# EAGLE design breakout_STM32F030F4P6 (EAGLE 7.2.0)
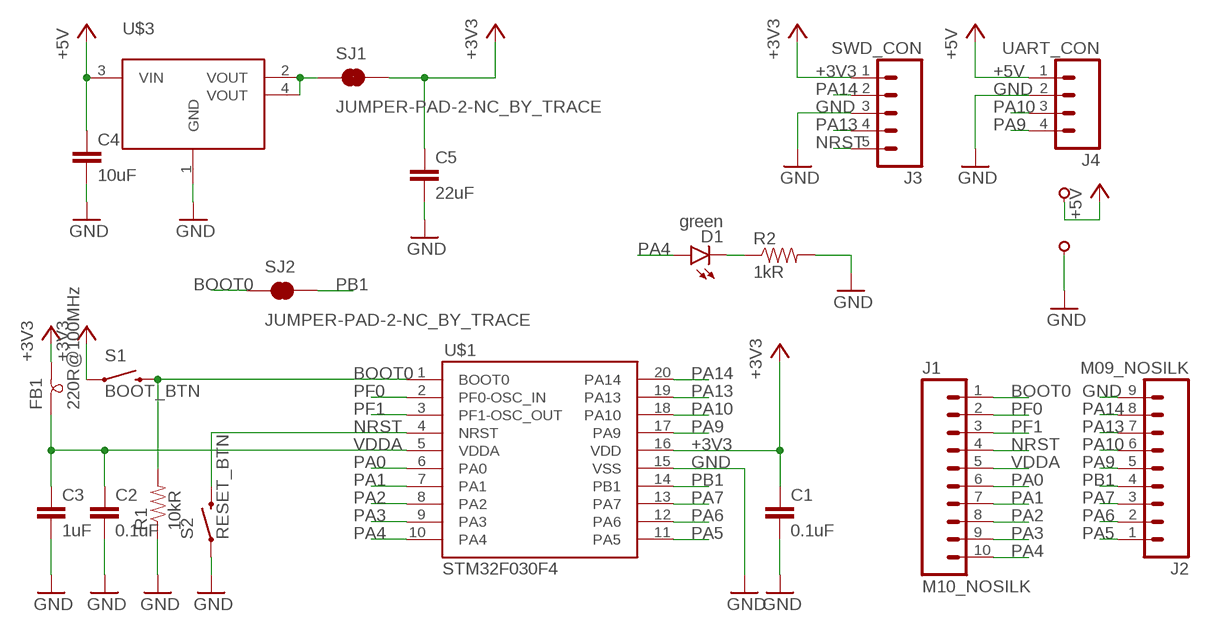
[diagram p0: schematic, sheet 1]

## Parts
C1  0.1uF  CAPACITOR0805  [0805]
C2  0.1uF  CAPACITOR0805  [0805]
C3  1uF  CAPACITOR0805  [0805]
C4  10uF  CAPACITOR0805  [0805]
C5  22uF  CAPACITOR0805  [0805]
D1  green  LED805  [LED-805]
FB1  220R@100MHz  FERRITE-BEAD0805  [0805]
J1  M10_NOSILK  [M10_NOSILK]
J2  M09_NOSILK  [M09_NOSILK]
J3  SWD_CON  M05_NOSILK_1SQ  [M05_NOSILK_1SQ]
J4  UART_CON  M04_NOSILK_1SQ  [M04_NOSILK_1SQ]
R1  10kR  RESISTOR0805  [0805]
R2  1kR  RESISTOR0805  [0805]
S1  BOOT_BTN  SWITCH-MOMENTARY-2-SMD-1101NE  [TACTILE-SWITCH-1101NE]
S2  RESET_BTN  SWITCH-MOMENTARY-2-SMD-1101NE  [TACTILE-SWITCH-1101NE]
SJ1  JUMPER-PAD-2-NC_BY_TRACE  [PAD-JUMPER-2-NC_BY_TRACE_YES_SILK]
SJ2  JUMPER-PAD-2-NC_BY_TRACE  [PAD-JUMPER-2-NC_BY_TRACE_YES_SILK]
U$1  STM32F030F4  [TSSOP-20]
U$2  M01_1SQ  [M01_1SQ]
U$3  AMS1117_SOT223  [SOT223]
U$4  M01_NOSILK  [M01_NOSILK]

## Nets
+3V3: C1.1 C5.1 FB1.2 J3.1 S1.1 SJ1.2 U$1.16(VDD)
+5V: C4.1 J4.1 U$2.1 U$3.3(VIN)
BOOT0: J1.1 R1.2 S1.2 SJ2.1 U$1.1(BOOT0)
GND: C1.2 C2.2 C3.2 C4.2 C5.2 J2.9 J3.3 J4.2 R1.1 R2.2 S2.1 U$1.15(VSS) U$3.1(GND) U$4.1
N$1: SJ1.1 U$3.2(VOUT) U$3.4(VOUT)
N$5: D1.C R2.1
NRST: J1.4 J3.5 S2.2 U$1.4(NRST)
PA0: J1.6 U$1.6(PA0)
PA1: J1.7 U$1.7(PA1)
PA2: J1.8 U$1.8(PA2)
PA3: J1.9 U$1.9(PA3)
PA4: D1.A J1.10 U$1.10(PA4)
PA5: J2.1 U$1.11(PA5)
PA6: J2.2 U$1.12(PA6)
PA7: J2.3 U$1.13(PA7)
PA9: J2.5 J4.4 U$1.17(PA9)
PA10: J2.6 J4.3 U$1.18(PA10)
PA13: J2.7 J3.4 U$1.19(PA13)
PA14: J2.8 J3.2 U$1.20(PA14)
PB1: J2.4 SJ2.2 U$1.14(PB1)
PF0: J1.2 U$1.2(PF0-OSC_IN)
PF1: J1.3 U$1.3(PF1-OSC_OUT)
VDDA: C2.1 C3.1 FB1.1 J1.5 U$1.5(VDDA)

## Library data of the parts
C1-C5 = flabbergast:CAPACITOR
D1 = flabbergast:LED: Blue LEDs for production use Various blue LEDs stocked by SparkFun production 0603 - DIO-08575 Rebel - DIO-09553 1206 - DIO-09911
FB1 = flabbergast:FERRITE-BEAD
J1 = flabbergast:M10
J2 = flabbergast:M09
J3 = flabbergast:M05
J4 = flabbergast:M04
R1 R2 = flabbergast:RESISTOR
S1 S2 = SparkFun-Electromechanical:SWITCH-MOMENTARY-2: Various NO switches- pushbuttons, reed, etc
SJ1 SJ2 = SparkFun-Passives:JUMPER-PAD-2-NC_BY_TRACE
U$1 = flabbergast:STM32F030F4
U$2 U$4 = flabbergast:M01
U$3 = flabbergast:AMS1117

## Board
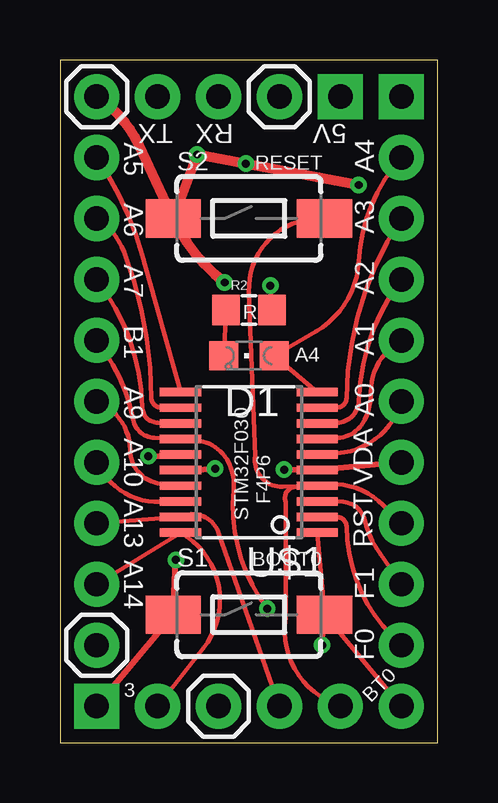
[diagram p1: board, top side]
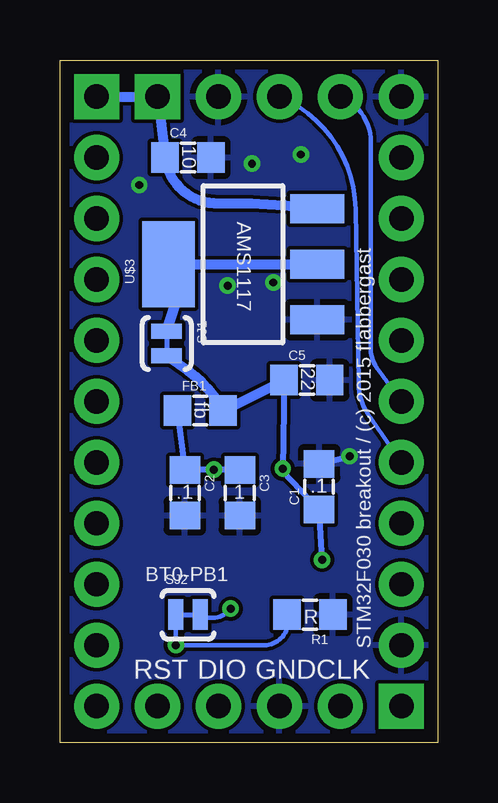
[diagram p2: board, bottom side, seen from below]

Size 15.75 x 28.45 mm. Coordinates in mm from the lower left corner, seen from the top.
Outline: 0,0 15.75,0 15.75,28.45 0,28.45 0,0
Copper layers (1*16): Top 0.0356mm / dielectric 1.5011mm / Bottom 0.0356mm
Design rules "LaenPCBOrder *": minimum track width 6mil, minimum drill 13mil, track to track 6mil, track to pad 6mil, pad to pad 6mil, via to via 6mil, smd to smd 0mil, copper to edge 15mil, drill to drill 6mil, minimum pad ring 7mil, minimum via ring 7mil, stop-mask expansion 3mil, vias tented up to drill 25mil, thermal gap 10mil

### Footprints (pad centres in the part's own frame; a part is rotated, then mirrored left to right if it is on the bottom)
0805 = smd 1.143 x 1.27: 1 -0.953,0; 2 0.953,0
LED-805 = smd 1.2 x 1.2: A 0,-1.05; C 0,1.05
M10_NOSILK = drill 1.016 pad 1.88: 1 -10.16,0; 2 -7.62,0; 3 -5.08,0; 4 -2.54,0; 5 0,0; 6 2.54,0; 7 5.08,0; 8 7.62,0; 9 10.16,0; 10 12.7,0
M09_NOSILK = drill 1.016 pad 1.88: 1 -10.16,0; 2 -7.62,0; 3 -5.08,0; 4 -2.54,0; 5 0,0; 6 2.54,0; 7 5.08,0; 8 7.62,0; 9 10.16,0
M05_NOSILK_1SQ = drill 1.016 pad 1.88 square: 1 -5.08,0 | drill 1.016 pad 1.88: 2 -2.54,0; 3 0,0; 4 2.54,0; 5 5.08,0
M04_NOSILK_1SQ = drill 1.016 pad 1.88 square: 1 -3.81,0 | drill 1.016 pad 1.88: 2 -1.27,0; 3 1.27,0; 4 3.81,0
TACTILE-SWITCH-1101NE = smd 2.3 x 1.6: 1 -3.15,0; 2 3.15,0
PAD-JUMPER-2-NC_BY_TRACE_YES_SILK = smd 0.635 x 1.27: 1 -0.508,0; 2 0.508,0
TSSOP-20 = smd 0.35 x 1.727: 1 -2.925,-2.845; 2 -2.275,-2.845; 3 -1.625,-2.845; 4 -0.975,-2.845; 5 -0.325,-2.845; 6 0.325,-2.845; 7 0.975,-2.845; 8 1.625,-2.845; 9 2.275,-2.845; 10 2.925,-2.845; 11 2.925,2.845; 12 2.275,2.845; 13 1.625,2.845; 14 0.975,2.845; 15 0.325,2.845; 16 -0.325,2.845; 17 -0.975,2.845; 18 -1.625,2.845; 19 -2.275,2.845; 20 -2.925,2.845
M01_1SQ = drill 1.016 pad 1.88 square: 1 0,0
SOT223 = smd 1.219 x 2.235: 1 -2.311,-3.099; 2 0,-3.099; 3 2.311,-3.099 | smd 3.6 x 2.2: 4 0,3.099
M01_NOSILK = drill 1.016 pad 1.88: 1 0,0

### Placement (x,y rotation side)
C1  4.95,10.67 90 bottom
C2  10.54,10.41 270 bottom
C3  8.25,10.41 270 bottom
C4  10.41,24.38 0 bottom
C5  5.46,15.11 0 bottom
D1  7.87,16.13 90 top
FB1  9.91,13.84 0 bottom
J1  14.22,11.68 90 top
J2  1.52,14.22 270 top
J3  6.6,1.52 0 top
J4  7.87,26.92 180 top
R1  5.33,5.33 180 bottom
R2  7.87,18.03 0 top
S1  7.87,5.33 0 top
S2  7.87,21.84 0 top
SJ1  11.3,16.64 270 bottom
SJ2  10.41,5.33 0 bottom
U$1  7.87,11.68 90 top
U$2  14.22,26.92 0 top
U$3  8.13,19.94 90 bottom
U$4  1.52,26.92 0 top

### Tracks (layer width: path | path; a pad name or v marks a point on that pad's centre or on a via)
+3V3  (via drill 0.33)
  Top 0.254: U$1.16 v6.47,11.42 | J3.1 S1.1 v4.83,7.62
  Bottom 0.254: C5.1 v6.47,11.42 6.48,11.3 C1.1 v4.83,7.62
  Bottom 0.406: SJ1.2 10.41,15.49 arc26 FB1.2 C5.1
+5V
  Bottom 0.406: U$2.1 J4.1 C4.1 arc-85 9.14,22.48 arc9 U$3.3
BOOT0  (via drill 0.33)
  Top 0.178: U$1.1 S1.2 | S1.2 J1.1 | S1.2 v10.92,4.06
  Bottom 0.178: R1.2 arc106 7.24,4.06 v10.92,4.06 SJ2.1
GND  (via drill 0.33)
  Top 0.178: R2.2 v8.76,19.05
  Top 0.254: v3.68,11.94 U$1.15
  Top 0.406: S2.1 3.3,24.89 arc32 U$4.1 | S2.1 arc27 v6.86,19.18 | S2.1 v5.71,24.51 v12.45,23.24
  Bottom 0.254: C1.2 v3.68,11.94
  other vias: 7.75,24.13
  pour Bottom: 0.25,0.25 15.49,0.25 15.49,28.19 0.25,28.19
N$1
  Bottom 0.406: U$3.4 10.41,19.94 | 10.41,19.94 U$3.2 | SJ1.1 10.41,19.94
N$5
  Top 0.178: D1.C R2.1
NRST
  Top 0.178: J1.4 13.46,9.91 arc57 U$1.4 | U$1.4 arc-19 9.91,10.67 arc116 9.4,10.03 9.4,5.21 arc81 J3.5 | U$1.4 9.27,10.67 arc-99 8.13,11.94 7.87,18.8 arc-96 S2.2
PA0
  Top 0.178: U$1.6 11.56,12.06 arc70 J1.6
PA1
  Top 0.178: U$1.7 11.56,12.7 arc62 12.7,13.46 arc26 12.95,14.61 arc-62 J1.7
PA2
  Top 0.178: U$1.8 11.56,13.33 arc86 12.45,14.22 arc-35 J1.8
PA3
  Top 0.178: U$1.9 11.56,13.97 arc89 11.94,14.35 arc-32 J1.9
PA4
  Top 0.178: U$1.10 D1.A 10.67,17.14 arc57 12.45,20.07 arc-39 J1.10
PA5
  Top 0.178: U$1.11 3.43,20.32 arc19 J2.1
PA6
  Top 0.178: U$1.12 4.19,13.97 arc-89 3.81,14.35 arc20 2.67,20.45 arc38 J2.2
PA7
  Top 0.178: U$1.13 4.06,13.33 arc-87 3.43,13.97 arc36 J2.3
PA9
  Top 0.178: U$1.17 4.19,10.79 arc-84 2.92,12.19 arc68 J2.5
  Bottom 0.178: J2.5 2.54,15.62 arc40 2.79,16.51 2.79,25.02 arc-67 J4.4
PA10
  Top 0.178: U$1.18 4.19,10.03 arc-67 J2.6
  Bottom 0.178: J2.6 2.92,13.72 arc36 3.3,14.99 3.43,22.23 arc-66 J4.3
PA13
  Top 0.178: J3.4 6.6,8.76 arc97 U$1.19 J2.7
PA14
  Top 0.178: J3.2 5.97,3.94 arc99 U$1.20 J2.8
PB1  (via drill 0.33)
  Top 0.178: J2.4 arc-28 3.05,13.46 arc77 3.94,12.7 U$1.14 arc-8 5.84,12.57 arc-44 6.86,11.94 arc-41 7.24,10.54 arc42 v8.64,5.59
  Bottom 0.178: v8.64,5.59 arc84 SJ2.2
PF0
  Top 0.178: U$1.2 11.56,9.4 arc-89 11.94,9.02 arc48 J1.2
PF1
  Top 0.178: J1.3 13.33,7.87 arc-21 12.7,9.27 arc71 11.81,10.03 arc7 U$1.3
VDDA  (via drill 0.33)
  Top 0.254: J1.5 U$1.5 v9.34,11.38
  Bottom 0.254: FB1.1 C2.1 v9.34,11.38 | C3.1 v9.34,11.38 | v9.34,11.38 9.28,11.5

### Text on the board
tPlace: TX | RX | 5V | A5 | RESET | A4 | A6 | A3 | A7 | A2 | B1 | R | A4 | A1 | A9 | A0 | A10 | A13 | VDA | STM32F030 / F4P6 | RST | A14 | BOOT0 | F1 | F0 | 3 | BT0
bPlace: 10 | AMS1117 | 22 | fb | .1 | 1 | .1 | BT0-PB1 | R | STM32F030 breakout / (c) 2015 flabbergast | CLK | GND | DIO | RST